# Altium project Fastino.PrjPCB (part 6 of 6)
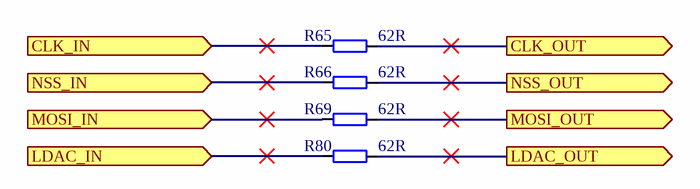
[diagram p9: Fastino_DAC_Series_Termination.SchDoc]

## Nets that join several sheets
GND: Fastino (48 pins), DAC_channel1 (22 pins), DAC_channel2 (22 pins), DAC_channel3 (22 pins), DAC_channel4 (22 pins), DAC_channel5 (22 pins), DAC_channel6 (22 pins), DAC_channel7 (22 pins), DAC_channel8 (22 pins), DAC_channel9 (22 pins), DAC_channel10 (22 pins), DAC_channel11 (22 pins), DAC_channel12 (22 pins), DAC_channel13 (22 pins), DAC_channel14 (22 pins), DAC_channel15 (22 pins), DAC_channel16 (22 pins), DAC_channel17 (22 pins), DAC_channel18 (22 pins), DAC_channel19 (22 pins), DAC_channel20 (22 pins), DAC_channel21 (22 pins), DAC_channel22 (22 pins), DAC_channel23 (22 pins), DAC_channel24 (22 pins), DAC_channel25 (22 pins), DAC_channel26 (22 pins), DAC_channel27 (22 pins), DAC_channel28 (22 pins), DAC_channel29 (22 pins), DAC_channel30 (22 pins), DAC_channel31 (22 pins), DAC_channel32 (22 pins), Fastino_FPGA (6 pins), Fastino_FPGA_Config (18 pins), Fastino_FPGA_LVDS (42 pins), Fastino_FPGA_Supply (44 pins), Fastino_References (55 pins), Fastino_Supply (55 pins)
N12V0A: DAC_channel1 (L18_1.1), DAC_channel2 (L18_2.1), DAC_channel3 (L18_3.1), DAC_channel4 (L18_4.1), DAC_channel5 (L18_5.1), DAC_channel6 (L18_6.1), DAC_channel7 (L18_7.1), DAC_channel8 (L18_8.1), DAC_channel9 (L18_9.1), DAC_channel10 (L18_10.1), DAC_channel11 (L18_11.1), DAC_channel12 (L18_12.1), DAC_channel13 (L18_13.1), DAC_channel14 (L18_14.1), DAC_channel15 (L18_15.1), DAC_channel16 (L18_16.1), DAC_channel17 (L18_17.1), DAC_channel18 (L18_18.1), DAC_channel19 (L18_19.1), DAC_channel20 (L18_20.1), DAC_channel21 (L18_21.1), DAC_channel22 (L18_22.1), DAC_channel23 (L18_23.1), DAC_channel24 (L18_24.1), DAC_channel25 (L18_25.1), DAC_channel26 (L18_26.1), DAC_channel27 (L18_27.1), DAC_channel28 (L18_28.1), DAC_channel29 (L18_29.1), DAC_channel30 (L18_30.1), DAC_channel31 (L18_31.1), DAC_channel32 (L18_32.1), Fastino_Supply (10 pins)
N13V0: Fastino (R170.1), Fastino_Supply (5 pins)
P1V2: Fastino_FPGA_Supply (16 pins), Fastino_Supply (R76.2 TP5.1)
P2V5: Fastino_FPGA_Supply (11 pins), Fastino_Supply (R152.2 TP10.1)
P3V3: Fastino_FPGA (C85.2 OSC1.1 OSC1.4 R53.1), Fastino_FPGA_Config (8 pins), Fastino_FPGA_LVDS (R74.1 R78.1 R84.1 R110.1), Fastino_FPGA_Supply (24 pins), Fastino_Supply (R51.1 R103.2 R159.1 TP11.1)
P3V3_MP: Fastino_FPGA_Config (15 pins), Fastino_FPGA_LVDS (22 pins), Fastino_Supply (R160.1 TP8.1)
P3V3A: Fastino_FPGA_Config (LD18.2), Fastino_FPGA_LVDS (LD19.2), Fastino_Supply (LD1.2 R52.1)
P5V4A: DAC_channel1 (L16_1.1 R164_1.1), DAC_channel2 (L16_2.1 R164_2.1), DAC_channel3 (L16_3.1 R164_3.1), DAC_channel4 (L16_4.1 R164_4.1), DAC_channel5 (L16_5.1 R164_5.1), DAC_channel6 (L16_6.1 R164_6.1), DAC_channel7 (L16_7.1 R164_7.1), DAC_channel8 (L16_8.1 R164_8.1), DAC_channel9 (L16_9.1 R164_9.1), DAC_channel10 (L16_10.1 R164_10.1), DAC_channel11 (L16_11.1 R164_11.1), DAC_channel12 (L16_12.1 R164_12.1), DAC_channel13 (L16_13.1 R164_13.1), DAC_channel14 (L16_14.1 R164_14.1), DAC_channel15 (L16_15.1 R164_15.1), DAC_channel16 (L16_16.1 R164_16.1), DAC_channel17 (L16_17.1 R164_17.1), DAC_channel18 (L16_18.1 R164_18.1), DAC_channel19 (L16_19.1 R164_19.1), DAC_channel20 (L16_20.1 R164_20.1), DAC_channel21 (L16_21.1 R164_21.1), DAC_channel22 (L16_22.1 R164_22.1), DAC_channel23 (L16_23.1 R164_23.1), DAC_channel24 (L16_24.1 R164_24.1), DAC_channel25 (L16_25.1 R164_25.1), DAC_channel26 (L16_26.1 R164_26.1), DAC_channel27 (L16_27.1 R164_27.1), DAC_channel28 (L16_28.1 R164_28.1), DAC_channel29 (L16_29.1 R164_29.1), DAC_channel30 (L16_30.1 R164_30.1), DAC_channel31 (L16_31.1 R164_31.1), DAC_channel32 (L16_32.1 R164_32.1), Fastino_References (29 pins), Fastino_Supply (8 pins)
P12V0: Fastino_FPGA_LVDS (8 pins), Fastino_Supply (5 pins)
P12V0A: DAC_channel1 (L2_1.1), DAC_channel2 (L2_2.1), DAC_channel3 (L2_3.1), DAC_channel4 (L2_4.1), DAC_channel5 (L2_5.1), DAC_channel6 (L2_6.1), DAC_channel7 (L2_7.1), DAC_channel8 (L2_8.1), DAC_channel9 (L2_9.1), DAC_channel10 (L2_10.1), DAC_channel11 (L2_11.1), DAC_channel12 (L2_12.1), DAC_channel13 (L2_13.1), DAC_channel14 (L2_14.1), DAC_channel15 (L2_15.1), DAC_channel16 (L2_16.1), DAC_channel17 (L2_17.1), DAC_channel18 (L2_18.1), DAC_channel19 (L2_19.1), DAC_channel20 (L2_20.1), DAC_channel21 (L2_21.1), DAC_channel22 (L2_22.1), DAC_channel23 (L2_23.1), DAC_channel24 (L2_24.1), DAC_channel25 (L2_25.1), DAC_channel26 (L2_26.1), DAC_channel27 (L2_27.1), DAC_channel28 (L2_28.1), DAC_channel29 (L2_29.1), DAC_channel30 (L2_30.1), DAC_channel31 (L2_31.1), DAC_channel32 (L2_32.1), Fastino_Supply (9 pins)
P13V0: Fastino (R171.1), Fastino_Supply (C18.2 C112.2 IC13.1 IC13.2)
DAC_CLK32: Fastino (TP4.1), DAC_Series_Termination32 (R65_32.2)
DAC_LDACn32: Fastino (TP19.1), DAC_Series_Termination32 (R80_32.2)
DAC_MOSI32: Fastino (TP18.1), DAC_Series_Termination32 (R69_32.2)
DAC_NSS32: Fastino (TP15.1), DAC_Series_Termination32 (R66_32.2)
DAC_REF_P5V1: DAC_channel1 (6 pins), Fastino_References (R1.2)
DAC_REF_P5V2: DAC_channel2 (6 pins), Fastino_References (R16.2)
DAC_REF_P5V3: DAC_channel3 (6 pins), Fastino_References (R272.2)
DAC_REF_P5V4: DAC_channel4 (6 pins), Fastino_References (R34.2)
DAC_REF_P5V5: DAC_channel5 (6 pins), Fastino_References (R4.2)
DAC_REF_P5V6: DAC_channel6 (6 pins), Fastino_References (R58.2)
DAC_REF_P5V7: DAC_channel7 (6 pins), Fastino_References (R5.2)
DAC_REF_P5V8: DAC_channel8 (6 pins), Fastino_References (R62.2)
DAC_REF_P5V9: DAC_channel9 (6 pins), Fastino_References (R141.2)
DAC_REF_P5V10: DAC_channel10 (6 pins), Fastino_References (R6.2)
DAC_REF_P5V11: DAC_channel11 (6 pins), Fastino_References (R105.2)
DAC_REF_P5V12: DAC_channel12 (6 pins), Fastino_References (R144.2)
DAC_REF_P5V13: DAC_channel13 (6 pins), Fastino_References (R10.2)
DAC_REF_P5V14: DAC_channel14 (6 pins), Fastino_References (R106.2)
DAC_REF_P5V15: DAC_channel15 (6 pins), Fastino_References (R146.2)
DAC_REF_P5V16: DAC_channel16 (6 pins), Fastino_References (R12.2)
DAC_REF_P5V17: DAC_channel17 (6 pins), Fastino_References (R116.2)
DAC_REF_P5V18: DAC_channel18 (6 pins), Fastino_References (R147.2)
DAC_REF_P5V19: DAC_channel19 (6 pins), Fastino_References (R14.2)
DAC_REF_P5V20: DAC_channel20 (6 pins), Fastino_References (R118.2)
DAC_REF_P5V21: DAC_channel21 (6 pins), Fastino_References (R148.2)
DAC_REF_P5V22: DAC_channel22 (6 pins), Fastino_References (R124.2)
DAC_REF_P5V23: DAC_channel23 (6 pins), Fastino_References (R128.2)
DAC_REF_P5V24: DAC_channel24 (6 pins), Fastino_References (R149.2)
DAC_REF_P5V25: DAC_channel25 (6 pins), Fastino_References (R129.2)
DAC_REF_P5V26: DAC_channel26 (6 pins), Fastino_References (R130.2)
DAC_REF_P5V27: DAC_channel27 (6 pins), Fastino_References (R150.2)
DAC_REF_P5V28: DAC_channel28 (6 pins), Fastino_References (R131.2)
DAC_REF_P5V29: DAC_channel29 (6 pins), Fastino_References (R132.2)
DAC_REF_P5V30: DAC_channel30 (6 pins), Fastino_References (R163.2)
DAC_REF_P5V31: DAC_channel31 (6 pins), Fastino_References (R133.2)
DAC_REF_P5V32: DAC_channel32 (6 pins), Fastino_References (R136.2)
DAC_SPI_CLK1: Fastino_FPGA (U1.C3), DAC_Series_Termination1 (R65_1.1)
DAC_SPI_CLK2: Fastino_FPGA (U1.B3), DAC_Series_Termination2 (R65_2.1)
DAC_SPI_CLK3: Fastino_FPGA (U1.D5), DAC_Series_Termination3 (R65_3.1)
DAC_SPI_CLK4: Fastino_FPGA (U1.A5), DAC_Series_Termination4 (R65_4.1)
DAC_SPI_CLK5: Fastino_FPGA (U1.C6), DAC_Series_Termination5 (R65_5.1)
DAC_SPI_CLK6: Fastino_FPGA (U1.B9), DAC_Series_Termination6 (R65_6.1)
DAC_SPI_CLK7: Fastino_FPGA (U1.D9), DAC_Series_Termination7 (R65_7.1)
DAC_SPI_CLK8: Fastino_FPGA (U1.A11), DAC_Series_Termination8 (R65_8.1)
DAC_SPI_CLK9: Fastino_FPGA (U1.R3), DAC_Series_Termination9 (R65_9.1)
DAC_SPI_CLK10: Fastino_FPGA (U1.B10), DAC_Series_Termination10 (R65_10.1)
DAC_SPI_CLK11: Fastino_FPGA (U1.E10), DAC_Series_Termination11 (R65_11.1)
DAC_SPI_CLK12: Fastino_FPGA (U1.P7), DAC_Series_Termination12 (R65_12.1)
DAC_SPI_CLK13: Fastino_FPGA (U1.B15), DAC_Series_Termination13 (R65_13.1)
DAC_SPI_CLK14: Fastino_FPGA (U1.H11), DAC_Series_Termination14 (R65_14.1)
DAC_SPI_CLK15: Fastino_FPGA (U1.R9), DAC_Series_Termination15 (R65_15.1)
DAC_SPI_CLK16: Fastino_FPGA (U1.E11), DAC_Series_Termination16 (R65_16.1)
DAC_SPI_CLK17: Fastino_FPGA (U1.H12), DAC_Series_Termination17 (R65_17.1)
DAC_SPI_CLK18: Fastino_FPGA (U1.M11), DAC_Series_Termination18 (R65_18.1)
DAC_SPI_CLK19: Fastino_FPGA (U1.F12), DAC_Series_Termination19 (R65_19.1)
DAC_SPI_CLK20: Fastino_FPGA (U1.J14), DAC_Series_Termination20 (R65_20.1)
DAC_SPI_CLK21: Fastino_FPGA (U1.P15), DAC_Series_Termination21 (R65_21.1)
DAC_SPI_CLK22: Fastino_FPGA (U1.F13), DAC_Series_Termination22 (R65_22.1)
DAC_SPI_CLK23: Fastino_FPGA (U1.L12), DAC_Series_Termination23 (R65_23.1)
DAC_SPI_CLK24: Fastino_FPGA (U1.N10), DAC_Series_Termination24 (R65_24.1)
DAC_SPI_CLK25: Fastino_FPGA (U1.G11), DAC_Series_Termination25 (R65_25.1)
DAC_SPI_CLK26: Fastino_FPGA (U1.K13), DAC_Series_Termination26 (R65_26.1)
DAC_SPI_CLK27: Fastino_FPGA (U1.T6), DAC_Series_Termination27 (R65_27.1)
DAC_SPI_CLK28: Fastino_FPGA (U1.G13), DAC_Series_Termination28 (R65_28.1)
DAC_SPI_CLK29: Fastino_FPGA (U1.K12), DAC_Series_Termination29 (R65_29.1)
DAC_SPI_CLK30: Fastino_FPGA (U1.P6), DAC_Series_Termination30 (R65_30.1)
DAC_SPI_CLK31: Fastino_FPGA (U1.M12), DAC_Series_Termination31 (R65_31.1)
DAC_SPI_CLK32: Fastino_FPGA (U1.R2), DAC_Series_Termination32 (R65_32.1)
DAC_SPI_CLRn: Fastino (TP20.1), Fastino_FPGA (U1.A7)
DAC_SPI_LDACn1: Fastino_FPGA (U1.D4), DAC_Series_Termination1 (R80_1.1)
DAC_SPI_LDACn2: Fastino_FPGA (U1.A1), DAC_Series_Termination2 (R80_2.1)
DAC_SPI_LDACn3: Fastino_FPGA (U1.B5), DAC_Series_Termination3 (R80_3.1)
DAC_SPI_LDACn4: Fastino_FPGA (U1.D7), DAC_Series_Termination4 (R80_4.1)
DAC_SPI_LDACn5: Fastino_FPGA (U1.B7), DAC_Series_Termination5 (R80_5.1)
DAC_SPI_LDACn6: Fastino_FPGA (U1.C8), DAC_Series_Termination6 (R80_6.1)
DAC_SPI_LDACn7: Fastino_FPGA (U1.C9), DAC_Series_Termination7 (R80_7.1)
DAC_SPI_LDACn8: Fastino_FPGA (U1.C10), DAC_Series_Termination8 (R80_8.1)
DAC_SPI_LDACn9: Fastino_FPGA (U1.N5), DAC_Series_Termination9 (R80_9.1)
DAC_SPI_LDACn10: Fastino_FPGA (U1.D11), DAC_Series_Termination10 (R80_10.1)
DAC_SPI_LDACn11: Fastino_FPGA (U1.A15), DAC_Series_Termination11 (R80_11.1)
DAC_SPI_LDACn12: Fastino_FPGA (U1.L9), DAC_Series_Termination12 (R80_12.1)
DAC_SPI_LDACn13: Fastino_FPGA (U1.E13), DAC_Series_Termination13 (R80_13.1)
DAC_SPI_LDACn14: Fastino_FPGA (U1.J16), DAC_Series_Termination14 (R80_14.1)
DAC_SPI_LDACn15: Fastino_FPGA (U1.N9), DAC_Series_Termination15 (R80_15.1)
DAC_SPI_LDACn16: Fastino_FPGA (U1.B14), DAC_Series_Termination16 (R80_16.1)
DAC_SPI_LDACn17: Fastino_FPGA (U1.H14), DAC_Series_Termination17 (R80_17.1)
DAC_SPI_LDACn18: Fastino_FPGA (U1.T10), DAC_Series_Termination18 (R80_18.1)
DAC_SPI_LDACn19: Fastino_FPGA (U1.G12), DAC_Series_Termination19 (R80_19.1)
DAC_SPI_LDACn20: Fastino_FPGA (U1.J15), DAC_Series_Termination20 (R80_20.1)
DAC_SPI_LDACn21: Fastino_FPGA (U1.R14), DAC_Series_Termination21 (R80_21.1)
DAC_SPI_LDACn22: Fastino_FPGA (U1.F11), DAC_Series_Termination22 (R80_22.1)
DAC_SPI_LDACn23: Fastino_FPGA (U1.M13), DAC_Series_Termination23 (R80_23.1)
DAC_SPI_LDACn24: Fastino_FPGA (U1.R10), DAC_Series_Termination24 (R80_24.1)
DAC_SPI_LDACn25: Fastino_FPGA (U1.G10), DAC_Series_Termination25 (R80_25.1)
DAC_SPI_LDACn26: Fastino_FPGA (U1.J10), DAC_Series_Termination26 (R80_26.1)
DAC_SPI_LDACn27: Fastino_FPGA (U1.M8), DAC_Series_Termination27 (R80_27.1)
DAC_SPI_LDACn28: Fastino_FPGA (U1.G14), DAC_Series_Termination28 (R80_28.1)
DAC_SPI_LDACn29: Fastino_FPGA (U1.L13), DAC_Series_Termination29 (R80_29.1)
DAC_SPI_LDACn30: Fastino_FPGA (U1.R5), DAC_Series_Termination30 (R80_30.1)
DAC_SPI_LDACn31: Fastino_FPGA (U1.N12), DAC_Series_Termination31 (R80_31.1)
DAC_SPI_LDACn32: Fastino_FPGA (U1.N6), DAC_Series_Termination32 (R80_32.1)
DAC_SPI_NSS1: Fastino_FPGA (U1.E5), DAC_Series_Termination1 (R66_1.1)
DAC_SPI_NSS2: Fastino_FPGA (U1.C5), DAC_Series_Termination2 (R66_2.1)
DAC_SPI_NSS3: Fastino_FPGA (U1.E6), DAC_Series_Termination3 (R66_3.1)
DAC_SPI_NSS4: Fastino_FPGA (U1.A6), DAC_Series_Termination4 (R66_4.1)
DAC_SPI_NSS5: Fastino_FPGA (U1.C7), DAC_Series_Termination5 (R66_5.1)
DAC_SPI_NSS6: Fastino_FPGA (U1.F9), DAC_Series_Termination6 (R66_6.1)
DAC_SPI_NSS7: Fastino_FPGA (U1.D10), DAC_Series_Termination7 (R66_7.1)
DAC_SPI_NSS8: Fastino_FPGA (U1.B11), DAC_Series_Termination8 (R66_8.1)
DAC_SPI_NSS9: Fastino_FPGA (U1.T2), DAC_Series_Termination9 (R66_9.1)
DAC_SPI_NSS10: Fastino_FPGA (U1.C11), DAC_Series_Termination10 (R66_10.1)
DAC_SPI_NSS11: Fastino_FPGA (U1.A16), DAC_Series_Termination11 (R66_11.1)
DAC_SPI_NSS12: Fastino_FPGA (U1.T7), DAC_Series_Termination12 (R66_12.1)
DAC_SPI_NSS13: Fastino_FPGA (U1.B16), DAC_Series_Termination13 (R66_13.1)
DAC_SPI_NSS14: Fastino_FPGA (U1.J13), DAC_Series_Termination14 (R66_14.1)
DAC_SPI_NSS15: Fastino_FPGA (U1.T9), DAC_Series_Termination15 (R66_15.1)
DAC_SPI_NSS16: Fastino_FPGA (U1.D13), DAC_Series_Termination16 (R66_16.1)
DAC_SPI_NSS17: Fastino_FPGA (U1.H16), DAC_Series_Termination17 (R66_17.1)
DAC_SPI_NSS18: Fastino_FPGA (U1.T11), DAC_Series_Termination18 (R66_18.1)
DAC_SPI_NSS19: Fastino_FPGA (U1.D16), DAC_Series_Termination19 (R66_19.1)
DAC_SPI_NSS20: Fastino_FPGA (U1.K14), DAC_Series_Termination20 (R66_20.1)
DAC_SPI_NSS21: Fastino_FPGA (U1.R15), DAC_Series_Termination21 (R66_21.1)
DAC_SPI_NSS22: Fastino_FPGA (U1.D15), DAC_Series_Termination22 (R66_22.1)
DAC_SPI_NSS23: Fastino_FPGA (U1.P16), DAC_Series_Termination23 (R66_23.1)
DAC_SPI_NSS24: Fastino_FPGA (U1.L10), DAC_Series_Termination24 (R66_24.1)
DAC_SPI_NSS25: Fastino_FPGA (U1.G15), DAC_Series_Termination25 (R66_25.1)
DAC_SPI_NSS26: Fastino_FPGA (U1.M16), DAC_Series_Termination26 (R66_26.1)
DAC_SPI_NSS27: Fastino_FPGA (U1.T5), DAC_Series_Termination27 (R66_27.1)
DAC_SPI_NSS28: Fastino_FPGA (U1.F15), DAC_Series_Termination28 (R66_28.1)
DAC_SPI_NSS29: Fastino_FPGA (U1.N16), DAC_Series_Termination29 (R66_29.1)
DAC_SPI_NSS30: Fastino_FPGA (U1.T3), DAC_Series_Termination30 (R66_30.1)
DAC_SPI_NSS31: Fastino_FPGA (U1.L11), DAC_Series_Termination31 (R66_31.1)
DAC_SPI_NSS32: Fastino_FPGA (U1.T1), DAC_Series_Termination32 (R66_32.1)
DAC_SPI_SDI1: Fastino_FPGA (U1.D3), DAC_Series_Termination1 (R69_1.1)
DAC_SPI_SDI2: Fastino_FPGA (U1.C4), DAC_Series_Termination2 (R69_2.1)
DAC_SPI_SDI3: Fastino_FPGA (U1.A2), DAC_Series_Termination3 (R69_3.1)
DAC_SPI_SDI4: Fastino_FPGA (U1.D6), DAC_Series_Termination4 (R69_4.1)
DAC_SPI_SDI5: Fastino_FPGA (U1.B6), DAC_Series_Termination5 (R69_5.1)
DAC_SPI_SDI6: Fastino_FPGA (U1.F7), DAC_Series_Termination6 (R69_6.1)
DAC_SPI_SDI7: Fastino_FPGA (U1.E9), DAC_Series_Termination7 (R69_7.1)
DAC_SPI_SDI8: Fastino_FPGA (U1.A10), DAC_Series_Termination8 (R69_8.1)
DAC_SPI_SDI9: Fastino_FPGA (U1.P5), DAC_Series_Termination9 (R69_9.1)
DAC_SPI_SDI10: Fastino_FPGA (U1.B12), DAC_Series_Termination10 (R69_10.1)
DAC_SPI_SDI11: Fastino_FPGA (U1.B13), DAC_Series_Termination11 (R69_11.1)
DAC_SPI_SDI12: Fastino_FPGA (U1.T8), DAC_Series_Termination12 (R69_12.1)
DAC_SPI_SDI13: Fastino_FPGA (U1.C14), DAC_Series_Termination13 (R69_13.1)
DAC_SPI_SDI14: Fastino_FPGA (U1.H13), DAC_Series_Termination14 (R69_14.1)
DAC_SPI_SDI15: Fastino_FPGA (U1.M9), DAC_Series_Termination15 (R69_15.1)
DAC_SPI_SDI16: Fastino_FPGA (U1.C12), DAC_Series_Termination16 (R69_16.1)
DAC_SPI_SDI17: Fastino_FPGA (U1.G16), DAC_Series_Termination17 (R69_17.1)
DAC_SPI_SDI18: Fastino_FPGA (U1.T14), DAC_Series_Termination18 (R69_18.1)
DAC_SPI_SDI19: Fastino_FPGA (U1.F14), DAC_Series_Termination19 (R69_19.1)
DAC_SPI_SDI20: Fastino_FPGA (U1.K16), DAC_Series_Termination20 (R69_20.1)
DAC_SPI_SDI21: Fastino_FPGA (U1.P14), DAC_Series_Termination21 (R69_21.1)
DAC_SPI_SDI22: Fastino_FPGA (U1.C16), DAC_Series_Termination22 (R69_22.1)
DAC_SPI_SDI23: Fastino_FPGA (U1.M14), DAC_Series_Termination23 (R69_23.1)
DAC_SPI_SDI24: Fastino_FPGA (U1.P10), DAC_Series_Termination24 (R69_24.1)
DAC_SPI_SDI25: Fastino_FPGA (U1.F16), DAC_Series_Termination25 (R69_25.1)
DAC_SPI_SDI26: Fastino_FPGA (U1.L16), DAC_Series_Termination26 (R69_26.1)
DAC_SPI_SDI27: Fastino_FPGA (U1.P8), DAC_Series_Termination27 (R69_27.1)
DAC_SPI_SDI28: Fastino_FPGA (U1.E16), DAC_Series_Termination28 (R69_28.1)
DAC_SPI_SDI29: Fastino_FPGA (U1.L14), DAC_Series_Termination29 (R69_29.1)
DAC_SPI_SDI30: Fastino_FPGA (U1.N7), DAC_Series_Termination30 (R69_30.1)
DAC_SPI_SDI31: Fastino_FPGA (U1.T16), DAC_Series_Termination31 (R69_31.1)
DAC_SPI_SDI32: Fastino_FPGA (U1.P4), DAC_Series_Termination32 (R69_32.1)
EEM0_SCL: Fastino_FPGA (U1.M15), Fastino_FPGA_LVDS (IC36.4 R74.2)
EEM0_SDA: Fastino_FPGA (U1.J11), Fastino_FPGA_LVDS (IC36.1 R78.2)
EEM1_SCL: Fastino_FPGA (U1.R4), Fastino_FPGA_LVDS (IC36.8 R110.2)
EEM1_SDA: Fastino_FPGA (U1.M7), Fastino_FPGA_LVDS (IC36.11 R84.2)
En_AFE_PWR: Fastino_FPGA (U1.B4), Fastino_Supply (IC4.3 IC13.3 R48.2)
FLASH_SCK: Fastino_FPGA (U1.R11), Fastino_FPGA_Config (IC6.6 IC17.2 JP1.4)
FLASH_SDI: Fastino_FPGA (U1.P12), Fastino_FPGA_Config (IC6.5 IC17.3 JP1.2)
FLASH_SDO: Fastino_FPGA (U1.P11), Fastino_FPGA_Config (IC6.2 IC17.9 JP1.3)
FLASH_SS: Fastino_FPGA (U1.R12), Fastino_FPGA_Config (IC6.1 IC17.10 JP1.1 R204.1)
FPGA_CDONE: Fastino_FPGA (U1.M10), Fastino_FPGA_Config (JP1.10 R39.2 R41.1 T2.1)
FPGA_CRESET: Fastino_FPGA (U1.N11), Fastino_FPGA_Config (JP1.9 R42.2 R44.1 R46.2)
FPGA_CSBSEL0: Fastino_FPGA (U1.K11), Fastino_FPGA_Config (R47.2 SW1.8)
FPGA_CSBSEL1: Fastino_FPGA (U1.P13), Fastino_FPGA_Config (R31.2 SW1.7)
I2C0_SCL: Fastino_FPGA_Config (IC10.8 IC30.2), Fastino_FPGA_LVDS (9 pins)
I2C0_SDA: Fastino_FPGA_Config (IC10.7 IC30.1), Fastino_FPGA_LVDS (9 pins)
SW0: Fastino_FPGA (U1.K15), Fastino_FPGA_Config (R33.1)
SW1: Fastino_FPGA (U1.B8), Fastino_FPGA_Config (R35.1)

## Assembly variants
STD: not fitted C11 C15 C69 IC8
DNP parallel termination: not fitted C11 C15 C35_1 C35_2 C35_3 C35_4 C35_5 C35_6 C35_7 C35_8 C35_9 C35_10 C35_11 C35_12 C35_13 C35_14 C35_15 C35_16 C35_17 C35_18 C35_19 C35_20 C35_21 C35_22 C35_23 C35_24 C35_25 C35_26 C35_27 C35_28 C35_29 C35_30 C35_31 C35_32 C66_1 C66_2 C66_3 C66_4 C66_5 C66_6 C66_7 C66_8 C66_9 C66_10 C66_11 C66_12 C66_13 C66_14 C66_15 C66_16 C66_17 C66_18 C66_19 C66_20 C66_21 C66_22 C66_23 C66_24 C66_25 C66_26 C66_27 C66_28 C66_29 C66_30 C66_31 C66_32 C68_1 C68_2 C68_3 C68_4 C68_5 C68_6 C68_7 C68_8 C68_9 C68_10 C68_11 C68_12 C68_13 C68_14 C68_15 C68_16 C68_17 C68_18 C68_19 C68_20 C68_21 C68_22 C68_23 C68_24 C68_25 C68_26 C68_27 C68_28 C68_29 C68_30 C68_31 C68_32 C89_1 C89_2 C89_3 C89_4 C89_5 C89_6 C89_7 C89_8 C89_9 C89_10 C89_11 C89_12 C89_13 C89_14 C89_15 C89_16 C89_17 C89_18 C89_19 C89_20 C89_21 C89_22 C89_23 C89_24 C89_25 C89_26 C89_27 C89_28 C89_29 C89_30 C89_31 C89_32 R7